# EAGLE schematic kmSigGen_Schematics (EAGLE 9.4.2)
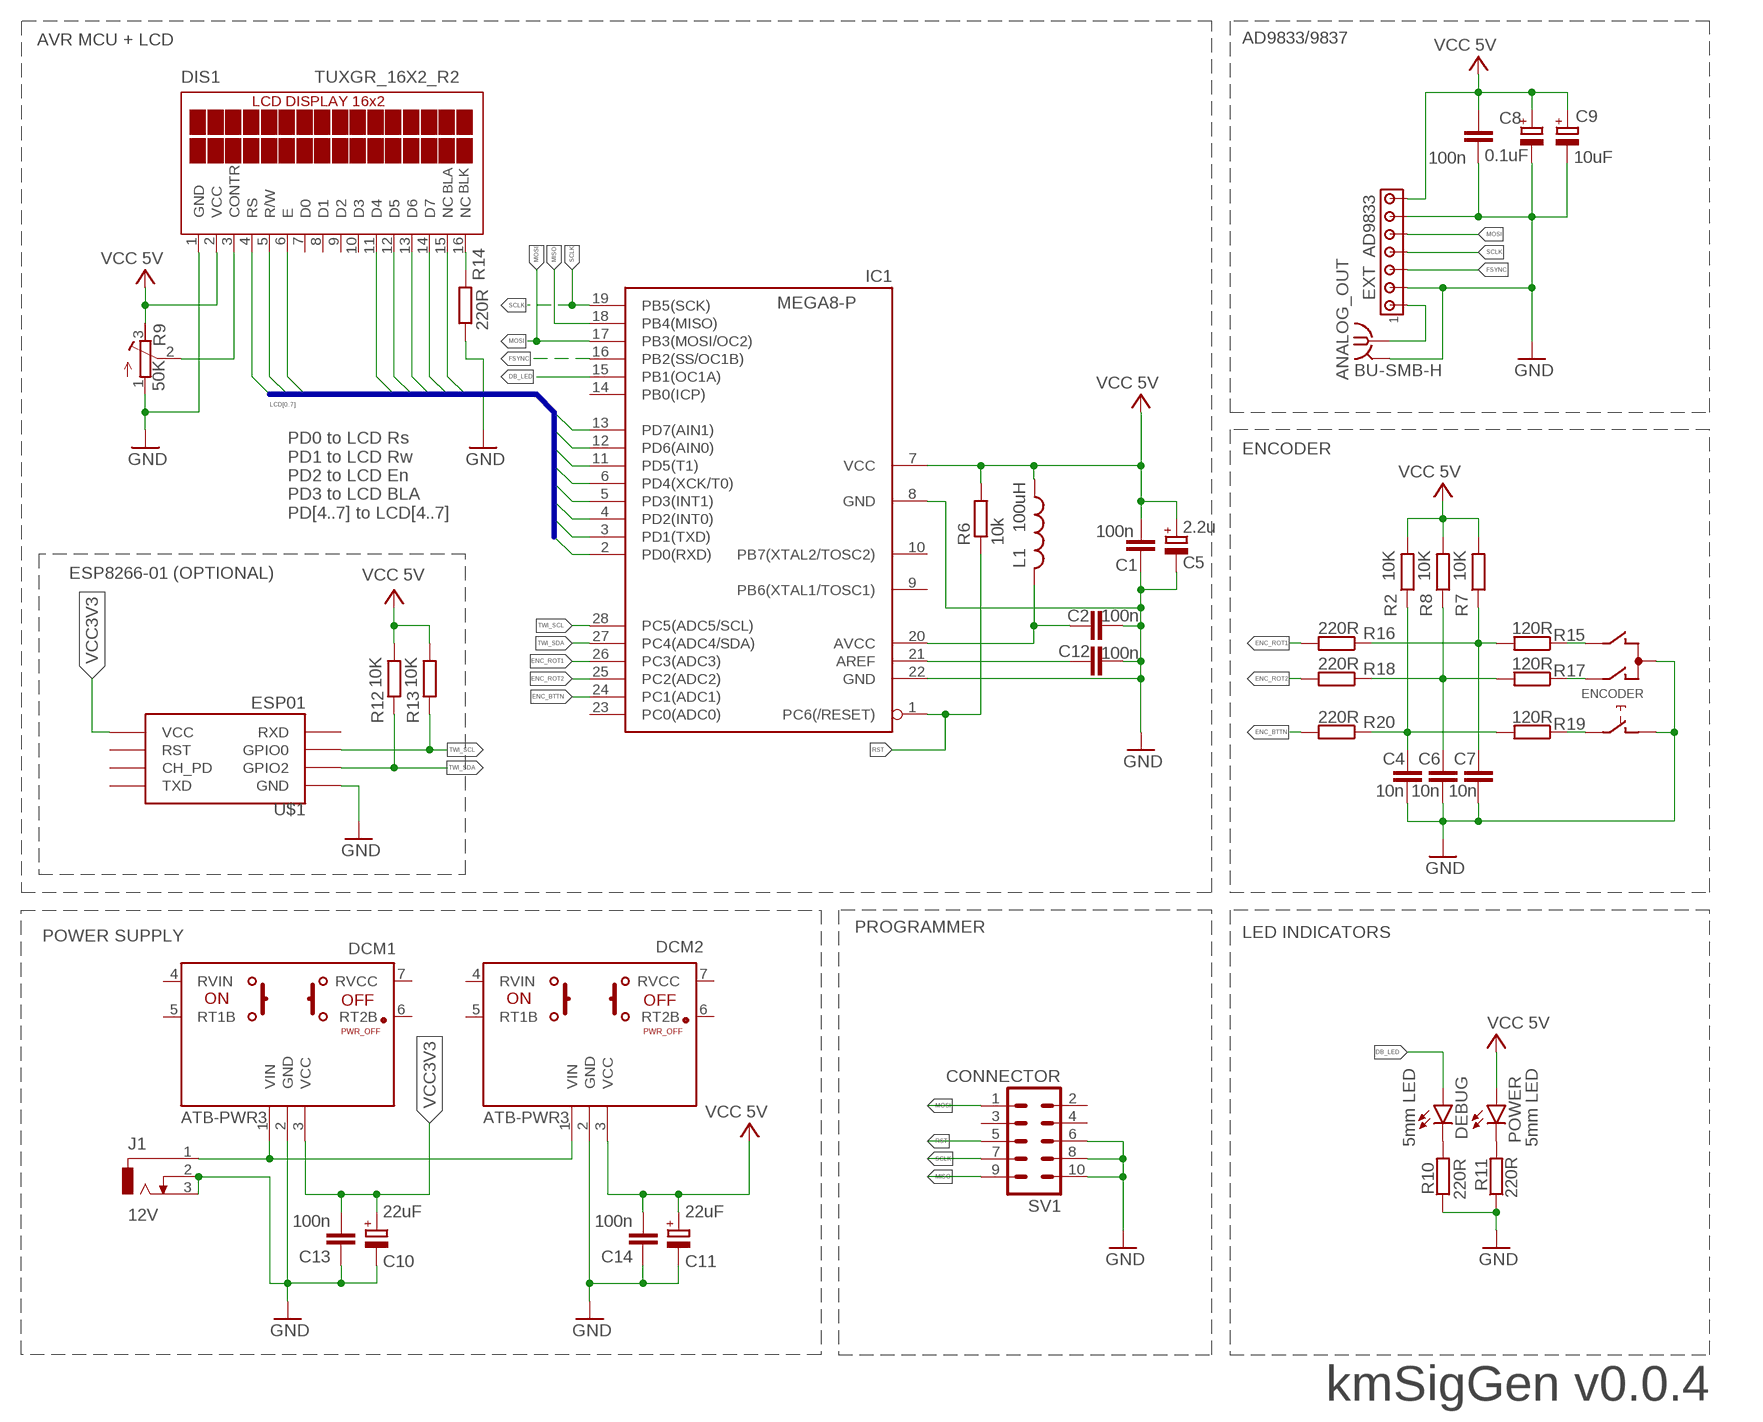
[diagram p0: schematic, sheet 1]

## Parts
ANALOG_OUT  BU-SMB-H  [BU-SMB-H]
C1  100n  C2.5/4  [C2.5-4]
C2  100n  C2.5/4  [C2.5-4]
C3  100n  C2.5/4  [C2.5-4]
C4  10n  C2.5/4  [C2.5-4]
C5  2.2u  CPOL-EUB45181B  [B45181B]
C6  10n  C2.5/4  [C2.5-4]
C7  10n  C2.5/4  [C2.5-4]
C8  0.1uF  CPOL-EUB45181B  [B45181B]
C9  10uF  CPOL-EUB45181B  [B45181B]
C10  22uF  CPOL-EUB45181B  [B45181B]
C11  22uF  CPOL-EUB45181B  [B45181B]
C12  100n  C2.5/4  [C2.5-4]
C13  100n  C2.5/4  [C2.5-4]
C14  100n  C2.5/4  [C2.5-4]
DCM1  ATB-PWR3  [ATB-PWR3]
DCM2  ATB-PWR3  [ATB-PWR3]
DEBUG  5mm LED  TLLG4400  [LED3MM]
DIS1  TUXGR_16X2_R2  [TUXGR_16X2_R2]
ENCODER  EC12E_SW  [ALPS_EC12E_SW]
EXT  AD9833  MTA07-100  [10X07MTA]
IC1  MEGA8-P  [DIL28-3]
J1  12V  DCJ0303  [DCJ0303]
L1  100uH  L-USIR-2  [IR-2]
POWER  5mm LED  TLLG4400  [LED3MM]
R2  10K  R-EU_0207/10  [0207/10]
R6  10k  R-EU_0207/10  [0207/10]
R7  10K  R-EU_0207/10  [0207/10]
R8  10K  R-EU_0207/10  [0207/10]
R9  50K  R-TRIMM4G/J  [RTRIM4G/J]
R10  220R  R-EU_0207/10  [0207/10]
R11  220R  R-EU_0207/10  [0207/10]
R12  10K  R-EU_0207/10  [0207/10]
R13  10K  R-EU_0207/10  [0207/10]
R14  220R  R-EU_0207/10  [0207/10]
R15  120R  R-EU_0207/10  [0207/10]
R16  220R  R-EU_0207/10  [0207/10]
R17  120R  R-EU_0207/10  [0207/10]
R18  220R  R-EU_0207/10  [0207/10]
R19  120R  R-EU_0207/10  [0207/10]
R20  220R  R-EU_0207/10  [0207/10]
SV1  CONNECTOR  ML10  [ML10]
U$1  ESP01  [ESP01]

## Nets
AVCC: C2.2 IC1.20(AVCC) L1.2
DB_LED: DEBUG.A DEBUG.K(C) IC1.15(PB1(OC1A)) R10.2
ENC_BTTN: IC1.24(PC1(ADC1)) R20.2
ENC_ROT1: IC1.26(PC3(ADC3)) R16.2
ENC_ROT2: IC1.25(PC2(ADC2)) R18.2
FSYNC: EXT.3 IC1.16(PB2(SS/OC1B))
GND: ANALOG_OUT.2 ANALOG_OUT.3 ANALOG_OUT.4 ANALOG_OUT.5 C1.1 C2.1 C3.1 C4.2 C5.- C6.2 C7.2 C8.- C9.- C10.- C11.- C12.1 C13.1 C14.1 DCM1.2(GND) DCM2.2(GND) DIS1.1(GND) ENCODER.C ENCODER.D EXT.2 EXT.6 IC1.8(GND) IC1.22(GND) J1.2 J1.3 R9.1(A) R10.1 R11.1 R14.1 SV1.6 SV1.8 SV1.10 U$1.GND
LCD0: DIS1.4(RS) IC1.2(PD0(RXD))
LCD1: DIS1.5(R/W) IC1.3(PD1(TXD))
LCD2: DIS1.6(E) IC1.4(PD2(INT0))
LCD3: DIS1.15(NC) IC1.5(PD3(INT1))
LCD4: DIS1.11(D4) IC1.6(PD4(XCK/T0))
LCD5: DIS1.12(D5) IC1.11(PD5(T1))
LCD6: DIS1.13(D6) IC1.12(PD6(AIN0))
LCD7: DIS1.14(D7) IC1.13(PD7(AIN1))
MISO: IC1.18(PB4(MISO)) SV1.9
MOSI: EXT.5 IC1.17(PB3(MOSI/OC2)) SV1.1
N$1: DIS1.3(CONTR) R9.2(S)
N$2: DIS1.16(NC) R14.2
N$7: C12.2 IC1.21(AREF)
N$8: ENCODER.B R15.1
N$9: C7.1 R7.1 R15.2 R16.1
N$10: C6.1 R8.1 R17.2 R18.1
N$11: C4.1 R2.1 R19.2 R20.1
N$12: ENCODER.A R17.1
N$13: ENCODER.E R19.1
N$19: ANALOG_OUT.1 EXT.1
RST: IC1.1(PC6(/RESET)) R6.1 SV1.5
SCLK: EXT.4 IC1.19(PB5(SCK)) SV1.7
TWI_SCL: IC1.28(PC5(ADC5/SCL)) R13.1 U$1.GPIO0
TWI_SDA: IC1.27(PC4(ADC4/SDA)) R12.1 U$1.GPIO2
VCC: C1.2 C3.2 C5.+ C8.+ C9.+ C11.+ C14.2 DCM2.3(VCC) DIS1.2(VCC) EXT.7 IC1.7(VCC) L1.1 POWER.A POWER.K(C) R2.2 R6.2 R7.2 R8.2 R9.3(E) R11.2 R12.2 R13.2 ; supply symbol labelled VCC 5V
VCC3V3: C10.+ C13.2 DCM1.3(VCC) U$1.VCC
VIN: DCM1.1(VIN) DCM2.1(VIN) J1.1
Unconnected: DCM1.4(RVIN) DCM1.5(RT1B) DCM1.6(RT2B) DCM1.7(RVCC) DCM2.4(RVIN) DCM2.5(RT1B) DCM2.6(RT2B) DCM2.7(RVCC) DIS1.7(D0) DIS1.8(D1) DIS1.9(D2) DIS1.10(D3) ENCODER.GND1(G) ENCODER.GND2(G) IC1.9(PB6(XTAL1/TOSC1)) IC1.10(PB7(XTAL2/TOSC2)) IC1.14(PB0(ICP)) IC1.23(PC0(ADC0)) SV1.2 SV1.3 SV1.4 U$1.CH_PD U$1.RST U$1.RX(RXD) U$1.TX(TXD)

## Buses
LCD[0..7]

## Notes on the sheet
- AVR MCU + LCD | AD9833/9837
- BLA | BLK
- ENCODER
- PD0 to LCD Rs
  PD1 to LCD Rw
  PD2 to LCD En
  PD3 to LCD BLA
  PD[4..7] to LCD[4..7]
- ESP8266-01 (OPTIONAL)
- PROGRAMMER
- POWER SUPPLY | LED INDICATORS
- kmSigGen v0.0.4

## Library data of the parts
ANALOG_OUT = con-coax:BU-SMB-H: FEMALE SMB CONNECTOR Radiall distributor RS 112-3003; OC_FARNELL: unknown; OC_NEWARK: unknown
C1-C4 C6 C7 C12-C14 = capacitor-wima:C: CAPACITOR naming: grid - package width
C5 C8-C11 = rcl:CPOL-EU: POLARIZED CAPACITOR, European symbol; SPICEPREFIX: C
DCM1 DCM2 = _ATNEL:ATB-PWR3
DEBUG POWER = led:TLLG4400: Low Current (2mA) LED 3 mm Tinted Diffused Package color GREEN Source: Data sheet <http://www.farnell.com/datasheets/391098.pdf>; MF: VISHAY SEMICONDUCTOR; OC_FARNELL: 1612435
DIS1 = display-lcd:TUXGR_16X2_R2: Tuxgraphics LCD display 16x2 characters reflective, without background light Source: tuxgr_12x2_r2.pdf; OC_FARNELL: unknown; OC_NEWARK: unknown
ENCODER = switch-alps:EC12E_SW: ALPS rotary Encoder EC12E series with switch; MPN: EC12E2424407; OC_FARNELL: 1520813; OC_NEWARK: 74M1068
EXT = con-amp:MTA07-100: AMP connector
IC1 = atmel:MEGA8-P: MICROCONTROLLER 8 Kbytes FLASH, 1 kbytes SRAM, 512 bytes EEPROM, USART, 4-channel 10 bit ADC, 2-channel 8 bit ADC Pin compatible with Atmega48, ATMega88, ATMega168 Source: avr.lbr; OC_FARNELL: unknown; OC_NEWARK: unknown
J1 = con-jack:DCJ0303: DC POWER JACK Source: DCJ0303.pdf; OC_FARNELL: unknown; OC_NEWARK: unknown
L1 = rcl:L-US: INDUCTOR, American symbol; SPICEPREFIX: L
R2 R6-R8 R10-R20 = rcl:R-EU_: RESISTOR, European symbol; SPICEPREFIX: R
R9 = rcl:R-TRIMM: Trimm resistor; SPICEMODEL: X; SPICEPREFIXL: POT
SV1 = con-ml:ML10: HARTING; OC_FARNELL: unknown; OC_NEWARK: unknown
U$1 = esp8266modules:ESP01: ESP8266 Wifi module 01